# EAGLE design fancontrollermegashield (EAGLE 9.4.2)
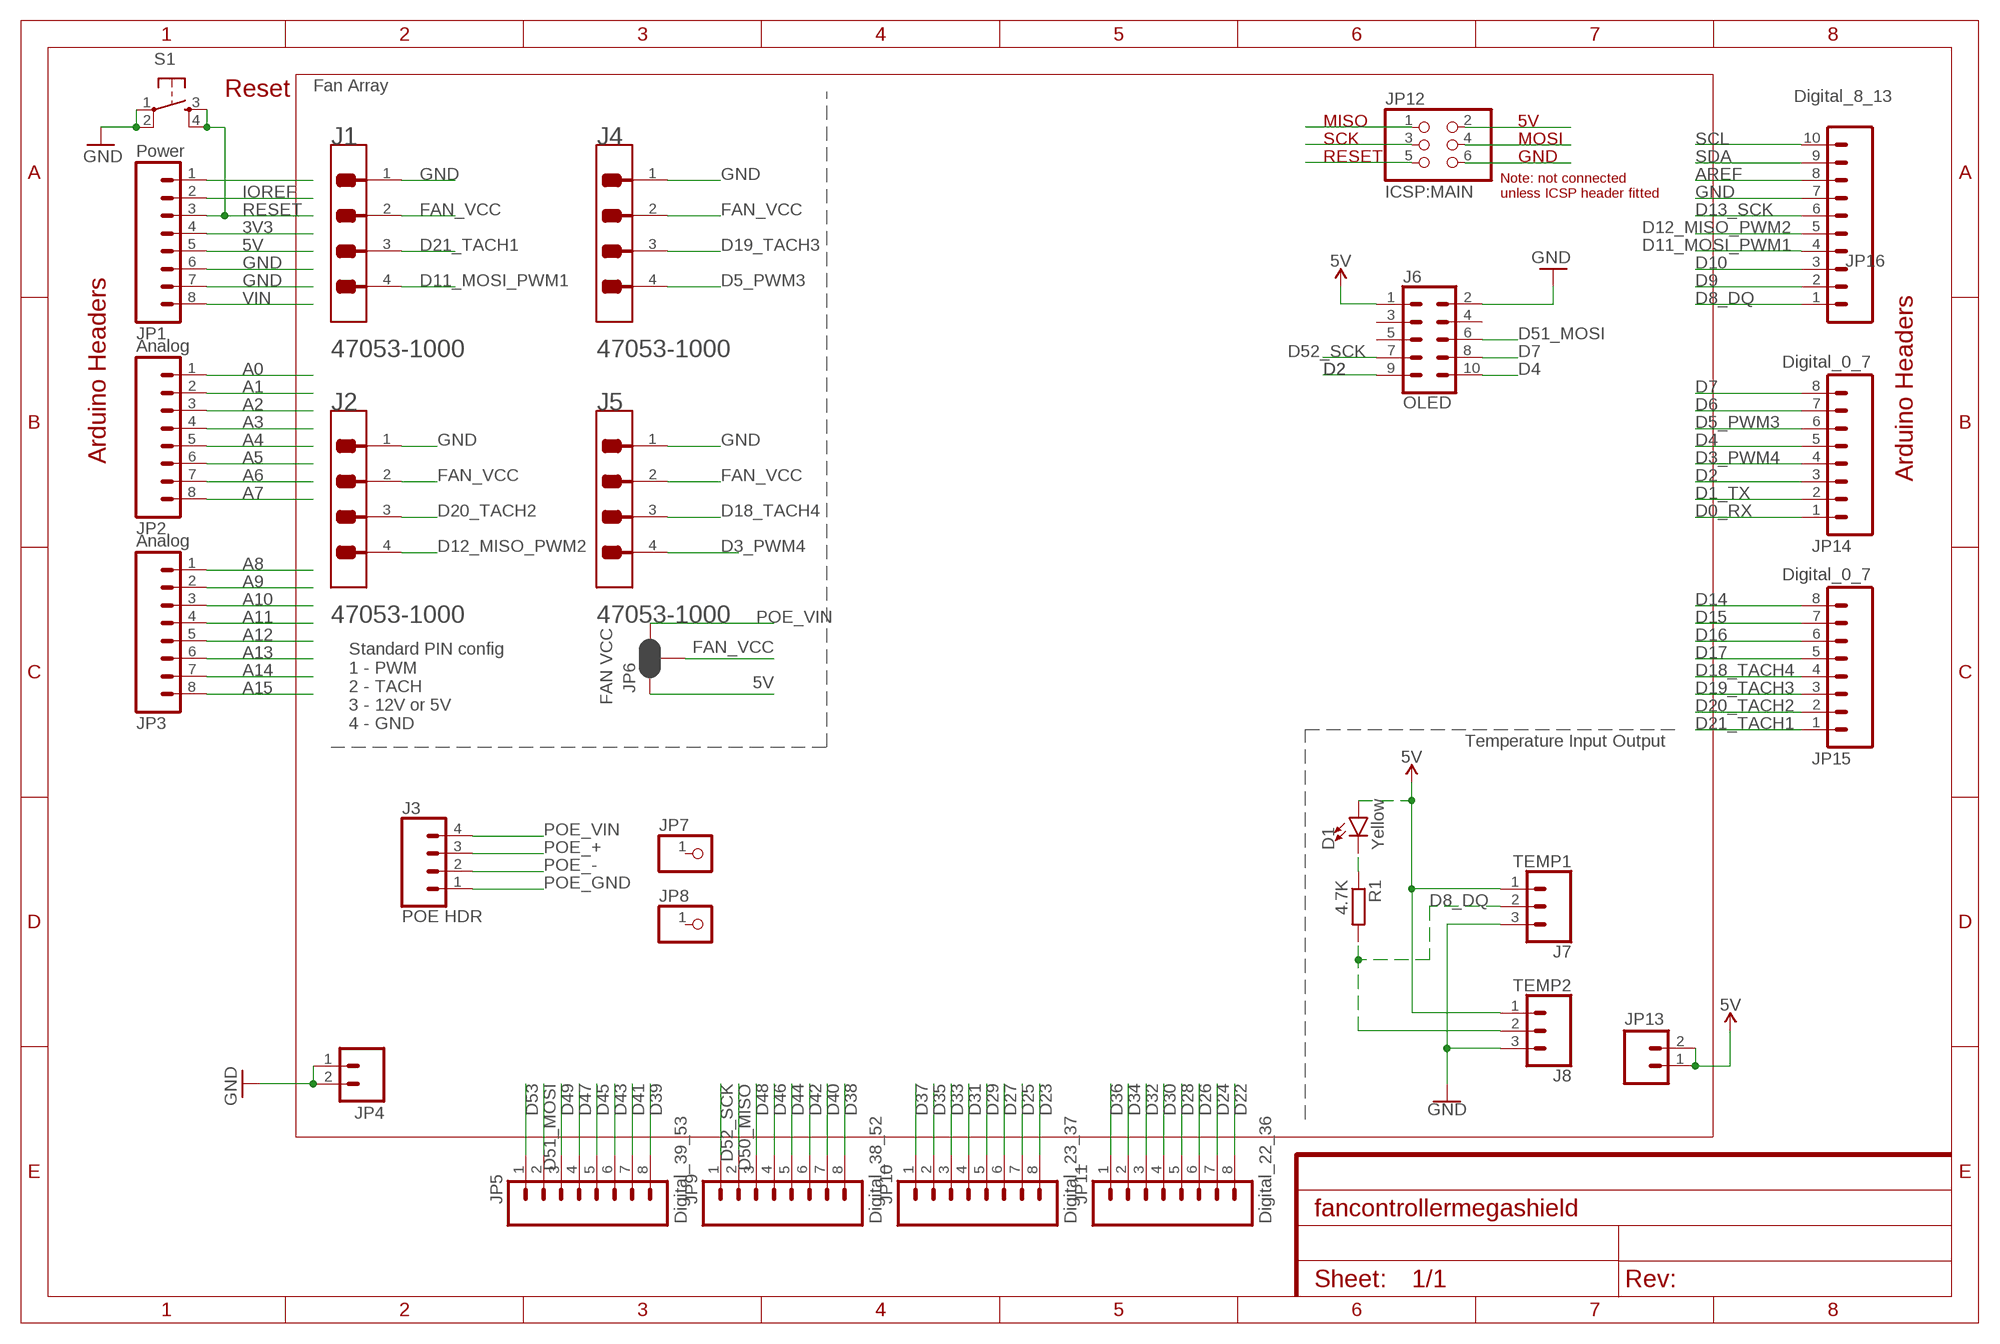
[diagram p0: schematic, sheet 1]

## Parts
D1  Yellow  LED-YELLOW0603  [LED-0603]
J1  FAN1  MOLEX_47053-1000MOLEX_47053-1000_0_0  [MOLEX_47053-1000_0]
J2  MOLEX_47053-1000MOLEX_47053-1000_0_0  [MOLEX_47053-1000_0]
J3  POE HDR  CONN_04  [1X04]
J4  MOLEX_47053-1000MOLEX_47053-1000_0_0  [MOLEX_47053-1000_0]
J5  MOLEX_47053-1000MOLEX_47053-1000_0_0  [MOLEX_47053-1000_0]
J6  OLED  CONN_05X2SHD  [2X5-SHROUDED]
J7  TEMP1  CONN_03POLAR  [MOLEX-1X3]
J8  TEMP2  CONN_03POLAR  [MOLEX-1X3]
JP1  Power  M08  [1X08]
JP2  Analog  M08  [1X08]
JP3  Analog  M08  [1X08]
JP4  M02PTH  [1X02]
JP5  Digital_39_53  M08  [1X08]
JP6  FAN VCC  JUMPER-SMT_3_2-NC_PASTE_SILK  [SMT-JUMPER_3_2-NC_PASTE_SILK]
JP7  PINHD-1X1  [1X01]
JP8  PINHD-1X1  [1X01]
JP9  Digital_38_52  M08  [1X08]
JP10  Digital_23_37  M08  [1X08]
JP11  Digital_22_36  M08  [1X08]
JP12  ICSP:MAIN  PINHD-2X3  [2X03]
JP13  M02PTH  [1X02]
JP14  Digital_0_7  M08  [1X08]
JP15  Digital_0_7  M08  [1X08]
JP16  Digital_8_13  M100.1  [1X10]
R1  4.7K  R-EU_R0603  [R0603]
S1  TAC_SWITCHPTH  [TACTILE-PTH]

## Nets
3V3: JP1.4
5V: D1.A J6.1 J7.1 J8.1 JP1.5 JP6.1 JP13.1 JP13.2
A0: JP2.1
A1: JP2.2
A2: JP2.3
A3: JP2.4
A4: JP2.5
A5: JP2.6
A6: JP2.7
A7: JP2.8
A8: JP3.1
A9: JP3.2
A10: JP3.3
A11: JP3.4
A12: JP3.5
A13: JP3.6
A14: JP3.7
A15: JP3.8
AREF: JP16.8
D0_RX: JP14.1
D1_TX: JP14.2
D2: J6.9 JP14.3
D3_PWM4: J5.4 JP14.4
D4: J6.10 JP14.5
D5_PWM3: J4.4 JP14.6
D6: JP14.7
D7: J6.8 JP14.8
D8_DQ: J7.2 J8.2 JP16.1 R1.2
D9: JP16.2
D10: JP16.3
D11_MOSI_PWM1: J1.4 JP16.4
D12_MISO_PWM2: J2.4 JP16.5
D13_SCK: JP16.6
D14: JP15.8
D15: JP15.7
D16: JP15.6
D17: JP15.5
D18_TACH4: J5.3 JP15.4
D19_TACH3: J4.3 JP15.3
D20_TACH2: J2.3 JP15.2
D21_TACH1: J1.3 JP15.1
D22: JP11.8
D23: JP10.8
D24: JP11.7
D25: JP10.7
D26: JP11.6
D27: JP10.6
D28: JP11.5
D29: JP10.5
D30: JP11.4
D31: JP10.4
D32: JP11.3
D33: JP10.3
D34: JP11.2
D35: JP10.2
D36: JP11.1
D37: JP10.1
D38: JP9.8
D39: JP5.8
D40: JP9.7
D41: JP5.7
D42: JP9.6
D43: JP5.6
D44: JP9.5
D45: JP5.5
D46: JP9.4
D47: JP5.4
D48: JP9.3
D49: JP5.3
D50_MISO: JP9.2
D51_MOSI: J6.6 JP5.2
D52_SCK: J6.7 JP9.1
D53: JP5.1
FAN_VCC: J1.2 J2.2 J4.2 J5.2 JP6.2
GND: J1.1 J2.1 J4.1 J5.1 J6.2 J7.3 J8.3 JP1.6 JP1.7 JP4.1 JP4.2 JP16.7 S1.1 S1.2
IOREF: JP1.2
N$1: D1.C R1.1
N$186: JP12.1
N$187: JP12.3
N$188: JP12.5
N$197: JP12.2
N$198: JP12.4
N$199: JP12.6
N$314: JP1.1
POE_+: J3.3
POE_-: J3.2
POE_GND: J3.1
POE_VIN: J3.4 JP6.3
RESET: JP1.3 S1.3 S1.4
SCL: JP16.10
SDA: JP16.9
VIN: JP1.8
Unconnected: J6.3 J6.4 J6.5 JP7.1 JP8.1

## Notes on the sheet
- Fan Array
- Reset
- MISO | 5V
- SCK | MOSI
- RESET | GND
- Note: not connected 
  unless ICSP header fitted
- Arduino Headers
- Arduino Headers
- Standard PIN config
  1 - PWM
  2 - TACH
  3 - 12V or 5V
  4 - GND
- Temperature Input Output

## Library data of the parts
D1 = SparkFun-LED:LED-YELLOW: Yellow SMD LED Used in manufacturing several products at SparkFun. Packages: 0603 - SMD 0603 package[Product Link] <http://www.kingbrightusa.com/product.asp?catalog_name=LED&product_id=APT1608SYCK> 0603 -SMART - SMART SMD 0603 package (more efficient/more expensive) [Product Link] <http://www.osram-os.com/osram_os/en/products/product-catalog/led-light-emitting-diodes/smartled-0603/ly-l29k/index.jsp> LilyPad - SMD1206 package[Product Datasheet] <https://www.sparkfun.com/datasheets/DevTools/LilyPad/Q150YUS4.pdf> SparkFun Products: Blynk Board <https://www.sparkfun.com/products/13794> IOIO-OTG <https://www.sparkfun.com/products/13613> XBee Explorer Serial <https://www.sparkfun.com/products/13225>; PROD_ID: DIO-09003
J1 J2 J4 J5 = Fortisec-Conn:MOLEX_47053-1000: 4-PIN HEADER HOUSING WITH FRICTION LOCK; CENTROID_NOT_SPECIFIED: Yes; CONTACT_TYPE: Male Pin; CURRENT: 4.0A; DATASHEET: http://www.molex.com/webdocs/datasheets/pdf/en-us//0470531000_PCB_HEADERS.pdf; DIGIKEY_DESCRIPTION: CONN 4 Positions Header, Unshrouded Connector 0.100" (2.54mm) Through Hole Tin; DIGIKEY_PART_NUMBER: WM4330-ND; IPC_LAND_PATTERN_NAME: HDRV4W65P_1X4_1020X65X1350; LEAD_FREE: yes; MF: Molex; MOUNTING_STYLE: Through Hole; MOUSER_PART_NUMBER: 538-47053-1000; MPN: 47053-1000; PACKAGE: CONN_4P254L; PITCH: 2.54mm; PREFIX: J; ROHS: yes; TEMPERATURE_RANGE_HIGH: +75°C; TEMPERATURE_RANGE_LOW: 0°C; VOLTAGE: 250V
J3 = SparkFun-Connectors:CONN_04: Multi connection point. Often used as Generic Header-pin footprint for 0.1 inch spaced/style header connections On any of the 0.1 inch spaced packages, you can populate with these: Break Away Headers - Straight <https://www.sparkfun.com/products/116> (PRT-00116) Break Away Male Headers - Right Angle <https://www.sparkfun.com/products/553> (PRT-00553) Female Headers <https://www.sparkfun.com/products/115> (PRT-00115) Break Away Headers - Machine Pin <https://www.sparkfun.com/products/117> (PRT-00117) Break Away Female Headers - Swiss Machine Pin <https://www.sparkfun.com/products/743> (PRT-00743) For SCREWTERMINALS and SPRING TERMINALS visit here: Screw Terimnals on SparkFun.com <https://www.sparkfun.com/search/results?term=Screw+Terminals> (5mm/3.5mm/2.54mm spacing) This device is also useful as a general connection point to wire up your design to another part of your project. Our various solder wires solder well into these plated through hole pads. Hook-Up Wire - Assortment (Stranded, 22 AWG) <https://www.sparkfun.com/products/11375> (PRT-11375) Hook-Up Wire - Assortment (Solid Core, 22 AWG) <https://www.sparkfun.com/products/11367> (PRT-11367) View the entire wire category on our website here <https://www.sparkfun.com/categories/141> Special notes: Molex polarized connector foot print use with SKU : PRT-08231 with associated crimp pins and housings. 1MM SMD Version SKU: PRT-10208; PROD_ID: CONN-09696
J6 = Fortisec-Conn:CONN_05X2: Multi connection point. Often used as Generic Header-pin footprint for 0.1 inch spaced/style header connections For AVR SPI programming port, see special device with nice symbol: "AVR_SPI_PROG_5x2.dev" You can populate with any combo of single row headers, but if you'd like an exact match, check these: 2x5 AVR ICSP Male Header <https://www.sparkfun.com/products/778> (PRT-00778) 2x5 Pin Shrouded Header <https://www.sparkfun.com/products/8506> (PRT-08506) On any of the 0.1 inch spaced packages, you can populate with these: Break Away Headers - Straight <https://www.sparkfun.com/products/116> (PRT-00116) Break Away Male Headers - Right Angle <https://www.sparkfun.com/products/553> (PRT-00553) Female Headers <https://www.sparkfun.com/products/115> (PRT-00115) Break Away Headers - Machine Pin <https://www.sparkfun.com/products/117> (PRT-00117) Break Away Female Headers - Swiss Machine Pin <https://www.sparkfun.com/products/743> (PRT-00743) Special note: the shrouded connector mates well with our 5x2 ribbon cables: 2x5 Pin IDC Ribbon Cable <https://www.sparkfun.com/products/8535> (PRT-08535); PROD_ID: CONN-08671; SF_ID: PRT-08506
J7 J8 = SparkFun-Connectors:CONN_03: Multi connection point. Often used as Generic Header-pin footprint for 0.1 inch spaced/style header connections On any of the 0.1 inch spaced packages, you can populate with these: Break Away Headers - Straight <https://www.sparkfun.com/products/116> (PRT-00116) Break Away Male Headers - Right Angle <https://www.sparkfun.com/products/553> (PRT-00553) Female Headers <https://www.sparkfun.com/products/115> (PRT-00115) Break Away Headers - Machine Pin <https://www.sparkfun.com/products/117> (PRT-00117) Break Away Female Headers - Swiss Machine Pin <https://www.sparkfun.com/products/743> (PRT-00743) Stackable Header - 3 Pin (Female, 0.1") <https://www.sparkfun.com/products/13875> (PRT-13875) For SCREWTERMINALS and SPRING TERMINALS visit here: Screw Terimnals on SparkFun.com <https://www.sparkfun.com/search/results?term=Screw+Terminals> (5mm/3.5mm/2.54mm spacing) This device is also useful as a general connection point to wire up your design to another part of your project. Our various solder wires solder well into these plated through hole pads. Hook-Up Wire - Assortment (Stranded, 22 AWG) <https://www.sparkfun.com/products/11375> (PRT-11375) Hook-Up Wire - Assortment (Solid Core, 22 AWG) <https://www.sparkfun.com/products/11367> (PRT-11367) View the entire wire category on our website here <https://www.sparkfun.com/categories/141> Special notes: Molex polarized connector foot print use with SKU : PRT-08232 with associated crimp pins and housings.; PROD_ID: CONN-08625; SF_ID: PRT-08096
JP1-JP3 = freetronics-master-v1:M08: Header 8 Standard 8-pin 0.1" header. Use with straight break away headers (SKU : PRT-00116), right angle break away headers (PRT-00553), swiss pins (PRT-00743), machine pins (PRT-00117), and female headers (PRT-00115).
JP4 JP13 = freetronics-master-v1:M02: Header 2 Standard 2-pin 0.1" header. Use with straight break away headers (SKU : PRT-00116), right angle break away headers (PRT-00553), swiss pins (PRT-00743), machine pins (PRT-00117), and female headers (PRT-00115). Molex polarized connector foot print use with SKU : PRT-08233 with associated crimp pins and housings.
JP5 JP9-JP11 JP14 JP15 = freetronics:M08: Header 8 Standard 8-pin 0.1" header. Use with straight break away headers (SKU : PRT-00116), right angle break away headers (PRT-00553), swiss pins (PRT-00743), machine pins (PRT-00117), and female headers (PRT-00115).
JP6 = SparkFun-Jumpers:JUMPER-SMT_3_2-NC_PASTE: Normally closed solder jumper (2 of 2 connections) This jumper has an aperture in the stencil to allow solder paste to bridge both connections. Both connections are normally closed (NC). Wick off the solder to open the connection(s). Reapply solder to reclose the connection(s).
JP7 JP8 = pinhead:PINHD-1X1: PIN HEADER
JP12 = pinhead:PINHD-2X3: PIN HEADER
JP16 = freetronics-original:M10: Header 10 Standard 10-pin 0.1" header. Use with straight break away headers (SKU : PRT-00116), right angle break away headers (PRT-00553), swiss pins (PRT-00743), machine pins (PRT-00117), and female headers (PRT-00115).
R1 = resistor:R-EU_: RESISTOR, European symbol
S1 = freetronics-master-v1:TAC_SWITCH: Momentary Switch Button commonly used for reset or general input. Spark Fun Electronics SKU : COM-00097

## Board
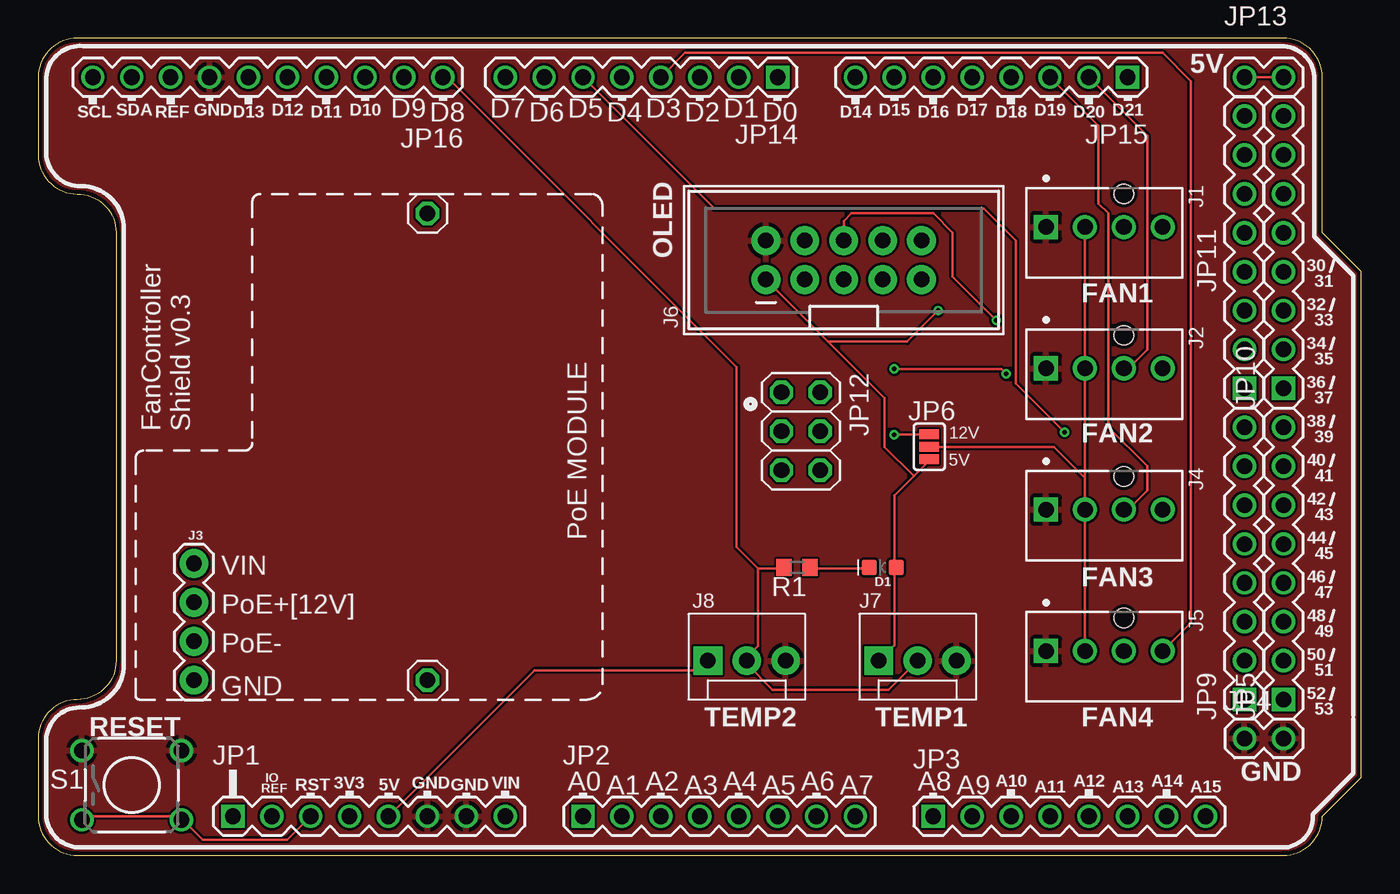
[diagram p1: board, top side]
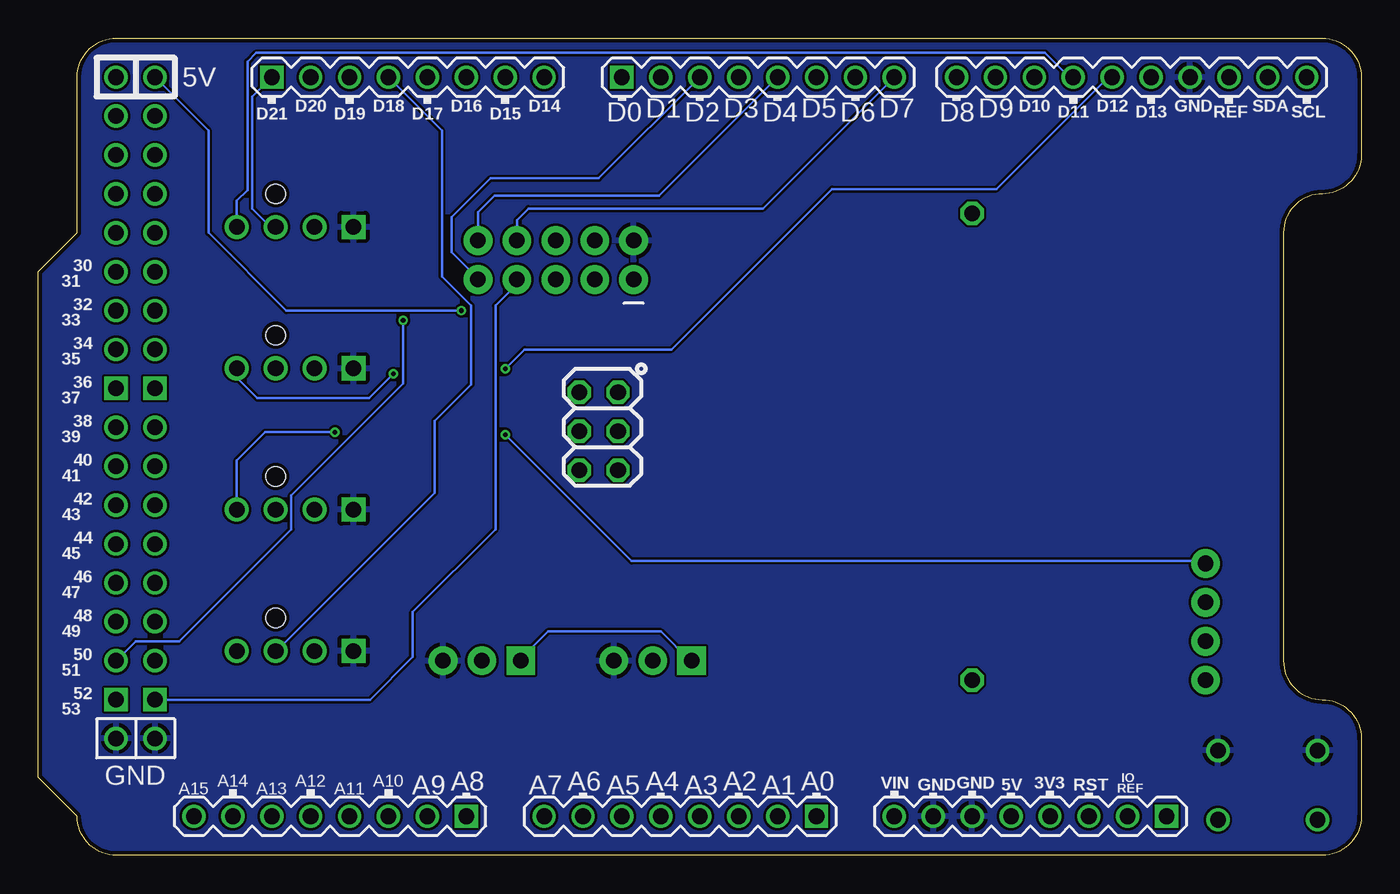
[diagram p2: board, bottom side, seen from below]

Size 86.36 x 53.34 mm. Coordinates in mm from the lower left corner, seen from the top.
Outline: 0,2.54 arc90 2.54,0 81.28,0 arc90 83.82,2.54 86.36,5.08 86.36,38.1 83.82,40.64 83.82,50.8 arc90 81.28,53.34 2.54,53.34 arc90 0,50.8 0,45.72 arc90 2.54,43.18 arc-90 5.08,40.64 5.08,12.7 arc-90 2.54,10.16 arc90 0,7.62 0,2.54
Copper layers (1*16): Top 0.035mm / dielectric 1.5mm / Bottom 0.035mm
Design rules "dirt_cheap_dirty_boards.v1.1": minimum track width 6mil, minimum drill 12mil, track to track 6mil, track to pad 6mil, pad to pad 6mil, via to via 6mil, smd to smd 0mil, copper to edge 10mil, drill to drill 10mil, minimum pad ring 10mil, minimum via ring 6mil, stop-mask expansion 2mil, vias tented up to drill 25mil, thermal gap 10mil

### Footprints (pad centres in the part's own frame; a part is rotated, then mirrored left to right if it is on the bottom)
LED-0603 = smd 1 x 1: A -0.877,0; C 0.877,0
MOLEX_47053-1000_0 = drill 1.02 pad 1.57 square: 1 -0.38,-3.81 | drill 1.02 pad 1.57: 2 -0.38,-1.27; 3 -0.38,1.27; 4 -0.38,3.81 | hole 1.25: -2.54,1.27
1X04 = drill 1.016 pad 1.88: 1 0,0; 2 2.54,0; 3 5.08,0; 4 7.62,0
2X5-SHROUDED = drill 1.016 pad 1.88: 1 -1.27,5.08; 2 1.27,5.08; 3 -1.27,2.54; 4 1.27,2.54; 5 -1.27,0; 6 1.27,0; 7 -1.27,-2.54; 8 1.27,-2.54; 9 -1.27,-5.08; 10 1.27,-5.08
MOLEX-1X3 = drill 1.016 pad 1.88 square: 1 0,0 | drill 1.016 pad 1.88: 2 2.54,0; 3 5.08,0
1X08 = drill 1.016 square: 1 0,0 | drill 1.016: 2 2.54,0; 3 5.08,0; 4 7.62,0; 5 10.16,0; 6 12.7,0; 7 15.24,0; 8 17.78,0
1X02 = drill 1.016: 1 0,0; 2 2.54,0
SMT-JUMPER_3_2-NC_PASTE_SILK = smd 0.635 x 1.27: 1 -0.813,0; 2 0,0; 3 0.813,0
1X01 = drill 1.016 octagon: 1 0,0
2X03 = drill 1.016 octagon: 1 -2.54,-1.27; 2 -2.54,1.27; 3 0,-1.27; 4 0,1.27; 5 2.54,-1.27; 6 2.54,1.27
1X10 = drill 1.016: 1 0,0; 2 2.54,0; 3 5.08,0; 4 7.62,0; 5 10.16,0; 6 12.7,0; 7 15.24,0; 8 17.78,0; 9 20.32,0; 10 22.86,0
R0603 = smd 1 x 1.1: 1 -0.85,0; 2 0.85,0
TACTILE-PTH = drill 1.016: 1 -3.251,2.261; 2 3.251,2.261; 3 -3.251,-2.261; 4 3.251,-2.261

### Placement (x,y rotation side)
D1  55.12,18.8 180 top
J1  69.6,40.64 270 top
J2  69.6,31.41 270 top
J3  10.16,11.43 90 top
J4  69.6,22.18 270 top
J5  69.6,12.95 270 top
J6  52.58,38.86 90 top
J7  54.86,12.7 0 top
J8  43.71,12.7 0 top
JP1  12.7,2.54 0 top
JP2  35.56,2.54 0 top
JP3  58.42,2.54 0 top
JP4  78.74,7.62 0 top
JP5  81.28,10.16 90 top
JP6  58.17,26.67 90 top
JP7  25.4,11.43 0 top
JP8  25.4,41.91 0 top
JP9  78.74,10.16 90 top
JP10  81.28,30.48 90 top
JP11  78.74,30.48 90 top
JP12  49.78,27.69 270 top
JP13  78.74,50.8 0 top
JP14  48.26,50.8 180 top
JP15  71.12,50.8 180 top
JP16  26.42,50.8 180 top
R1  49.53,18.8 180 top
S1  6.1,4.57 0 top

### Tracks (layer width: path | path; a pad name or v marks a point on that pad's centre or on a via)
5V  (via drill 0.3)
  Top 0.152: JP1.5 32.38,12.06 43.08,12.06 J8.1 | JP13.2 JP13.1 | 57.15,24.77 55.88,23.5 55.88,19.05 D1.A 55.88,18.73 55.88,13.72 J7.1 | 57.15,24.77 58.1,25.72 JP6.1 | 51.56,33.53 55.24,29.84 55.24,26.67 57.15,24.77 | 51.56,33.53 J6.1 | v58.74,35.56 56.71,33.53 51.56,33.53
  Bottom 0.152: JP13.1 75.25,47.31 75.25,40.64 70.17,35.56 v58.74,35.56 | J8.1 43.81,12.7 45.72,14.61 53.09,14.61 54.86,12.83 J7.1
D2
  Bottom 0.152: JP14.3 49.78,44.2 56.83,44.2 59.37,41.66 59.37,39.37 57.78,37.78 J6.9
D3_PWM4
  Top 0.152: JP14.4 42.23,52.39 73.41,52.39 75.25,50.55 75.25,15.18 J5.4
D4
  Bottom 0.152: JP14.5 45.85,43.05 56.58,43.05 57.66,41.97 J6.10
D5_PWM3  (via drill 0.3)
  Top 0.152: JP14.6 44.13,42.23 61.72,42.23 63.82,40.13 63.82,30.8 v66.99,27.62
  Bottom 0.152: v66.99,27.62 71.56,27.62 73.41,25.78 J4.4
D7
  Bottom 0.152: JP14.8 39.05,42.23 54.36,42.23 55.12,41.47 J6.8
D8_DQ
  Top 0.152: 46.99,18.73 48.58,18.73 R1.2 | 46.99,18.73 46.99,13.65 46.25,12.91 J8.2 46.25,12.49 47.94,10.79 55.5,10.79 J7.2 | JP16.1 26.67,50.8 45.59,31.88 45.59,20.13 46.99,18.73
D11_MOSI_PWM1
  Bottom 0.152: JP16.4 19.05,50.8 20.64,52.39 72.14,52.39 72.71,51.82 72.71,43.43 73.41,42.74 J1.4
D12_MISO_PWM2  (via drill 0.3)
  Top 0.152: v63.18,31.43 62.87,31.75 v55.88,31.75
  Bottom 0.152: v63.18,31.43 64.77,29.84 72.07,29.84 73.41,31.18 J2.4 | JP16.5 16.51,50.8 23.81,43.5 34.54,43.5 45.02,33.02 54.61,33.02 v55.88,31.75
D18_TACH4
  Bottom 0.152: JP15.4 60.01,47.31 60.01,37.78 58.1,35.88 58.1,30.73 60.48,28.35 60.48,23.65 70.8,13.34 J5.3
D19_TACH3
  Top 0.152: JP15.3 69.22,47.62 69.22,42.55 69.85,41.91 69.85,27.94 72.39,25.4 72.39,23.81 71.12,22.54 J4.3
D20_TACH2
  Top 0.152: JP15.2 72.39,46.99 72.39,33.02 71.16,31.79 J2.3
D21_TACH1
  Bottom 0.152: JP15.1 72.39,49.53 72.39,42.23 71.18,41.02 J1.3
D51_MOSI  (via drill 0.3)
  Top 0.152: v62.55,34.92 59.69,37.78 59.69,40.64 58.42,41.91 53.09,41.91 52.58,41.4 J6.6
  Bottom 0.152: JP5.2 80.01,13.97 77.15,13.97 69.85,21.27 69.85,23.5 62.55,30.8 v62.55,34.92
D52_SCK
  Bottom 0.152: JP9.1 64.71,10.16 61.91,12.95 61.91,15.88 56.52,21.27 56.52,35.88 55.12,37.27 J6.7
FAN_VCC
  Top 0.152: JP6.2 66.29,26.67 68.33,24.64 | J1.2 J2.2 68.33,24.64 | J5.2 J4.2 68.33,24.64
GND
  pour Bottom: 0,50.8 arc-74 2.54,53.34 81.28,53.34 arc-74 83.82,50.8 83.82,40.64 86.36,38.1 86.36,5.08 83.82,2.54 arc-74 81.28,0 1.27,0 arc-74 0,2.54 0,7.62 arc-90 2.54,10.16 arc90 5.08,12.7 5.08,40.64 arc90 2.54,43.18 arc-90 0,45.72
  pour Top: 0,50.8 arc-74 2.54,53.34 81.28,53.34 arc-74 83.82,50.8 83.82,40.64 86.36,38.1 86.36,5.08 83.82,2.54 arc-74 81.28,0 1.27,0 arc-74 0,2.54 0,7.62 arc-90 2.54,10.16 arc90 5.08,12.7 5.08,40.64 arc90 2.54,43.18 arc-90 0,45.72
N$1
  Top 0.152: D1.C 53.98,18.73 50.48,18.73 R1.1
POE_+
  Bottom 0.152: J3.3 10.79,17.14
POE_VIN  (via drill 0.3)
  Top 0.152: v55.88,27.46 58.1,27.46 JP6.3
  Bottom 0.152: v55.88,27.46 47.62,19.21 10.16,19.21 J3.4
RESET
  Top 0.152: S1.3 2.86,2.54 9.21,2.54 S1.4 9.53,2.22 10.73,1.02 16.26,1.02 JP1.3

### Text on the board
tPlace: 5V | SCL | SDA | REF | GND | D13 | D12 | D11 | D10 | D9 | D8 | D7 | D6 | D5 | D4 | D3 | D2 | D1 | D0 | D14 | D15 | D16 | D17 | D18 | D19 | D20 | D21 | 30 | 31 | 32 | 33 | 34 | 35 | 36 | 37 | 38 | 39 | 40 | 41 | 42 | 43 | 44 | 45 | 46 | 47 | 48 | 49 | 50 | 51 | 52 | 53 | RESET | IO | GND | REF | RST | 3V3 | 5V | GND | GND | VIN | A0 | A1 | A2 | A3 | A4 | A5 | A6 | A7 | A8 | A9 | A10 | A11 | A12 | A13 | A14 | A15
bPlace: 5V | SDA | GND | D12 | D10 | D14 | D16 | D18 | D20 | SCL | REF | D13 | D11 | D9 | D8 | D7 | D6 | D5 | D4 | D3 | D2 | D1 | D0 | D15 | D17 | D19 | D21 | 30 | 31 | 32 | 33 | 34 | 35 | 36 | 37 | 38 | 39 | 40 | 41 | 42 | 43 | 44 | 45 | 46 | 47 | 48 | 49 | 50 | 51 | 52 | 53 | IO | GND | REF | RST | 3V3 | 5V | GND | GND | VIN | A0 | A1 | A2 | A3 | A4 | A5 | A6 | A7 | A8 | A9 | A10 | A11 | A12 | A13 | A14 | A15
tNames: FAN1 | FanController / Shield v0.3 | 12V | FAN2 | 5V | PoE MODULE | VIN | FAN3 | PoE+[12V] | PoE- | GND | FAN4